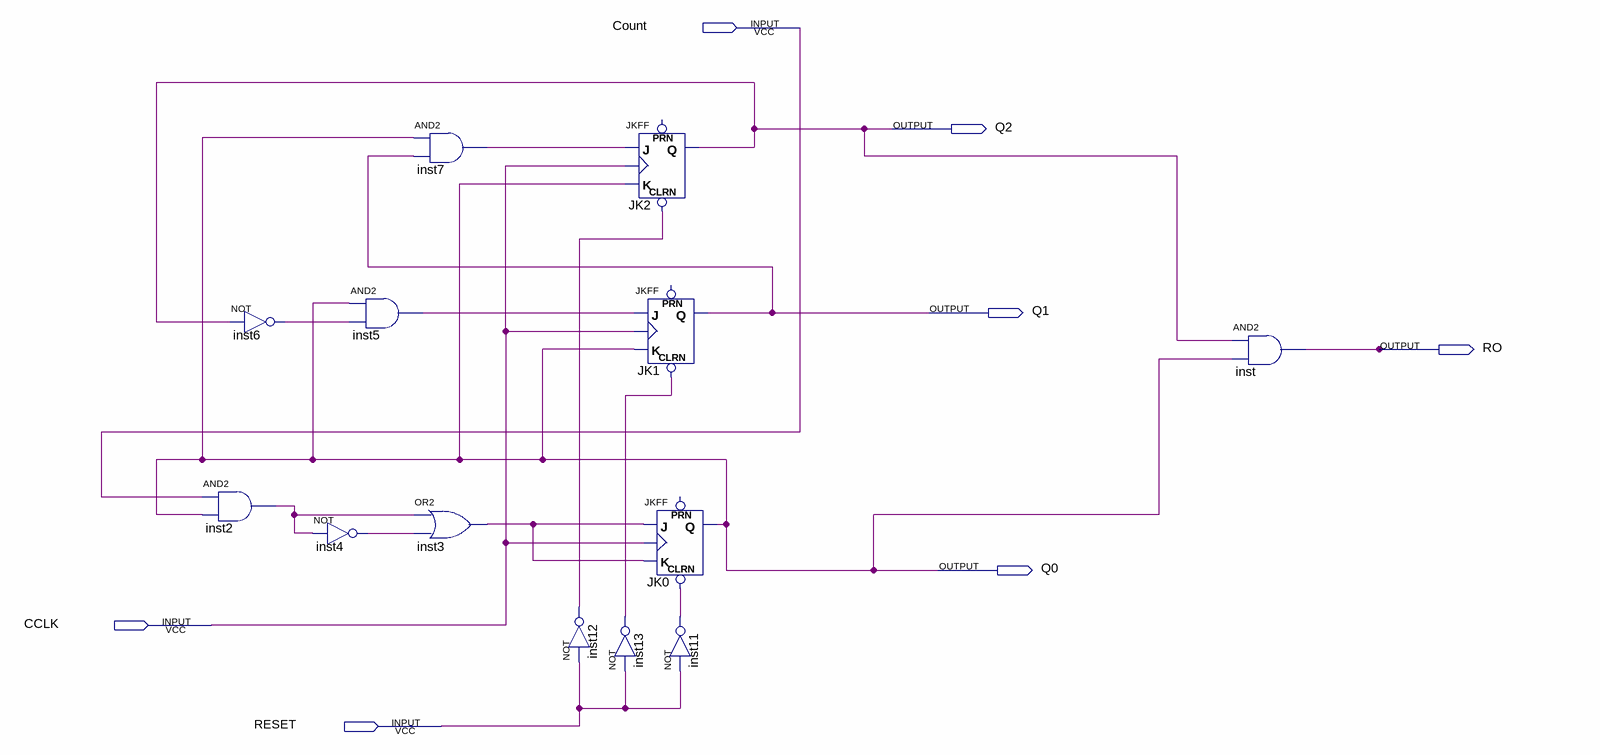
[diagram p0: schematic sheet]
// Quartus schematic lab2.bdf as structural Verilog: 13 symbols, 7 pins
module lab2 (
  input  Count,
  input  CCLK,
  input  RESET,
  output Q2,
  output Q1,
  output RO,
  output Q0
);

  wire inst2_out, inst3_out, inst4_out, inst5_out, inst6_out, inst7_out, inst11_out, inst12_out, inst13_out;

  and inst2 (inst2_out, Count, Q0);
  not inst6 (inst6_out, Q2);
  and inst5 (inst5_out, Q0, inst6_out);
  not inst4 (inst4_out, inst2_out);
  and inst7 (inst7_out, Q0, Q1);
  or inst3 (inst3_out, inst2_out, inst4_out);
  not inst12 (inst12_out, RESET);
  JKFF JK2 (.CLRN(inst12_out), .K(Q0), .J(inst7_out), .CLK(CCLK), .Q(Q2));  // open: PRN
  JKFF JK1 (.CLRN(inst13_out), .K(Q0), .J(inst5_out), .CLK(CCLK), .Q(Q1));  // open: PRN
  JKFF JK0 (.CLRN(inst11_out), .K(inst3_out), .J(inst3_out), .CLK(CCLK), .Q(Q0));  // open: PRN
  not inst11 (inst11_out, RESET);
  not inst13 (inst13_out, RESET);
  and inst (RO, Q2, Q0);
endmodule
